# EAGLE schematic communication_module_20190819_to_aj-doy (EAGLE 9.4.2)
AUTHOR: iPAS
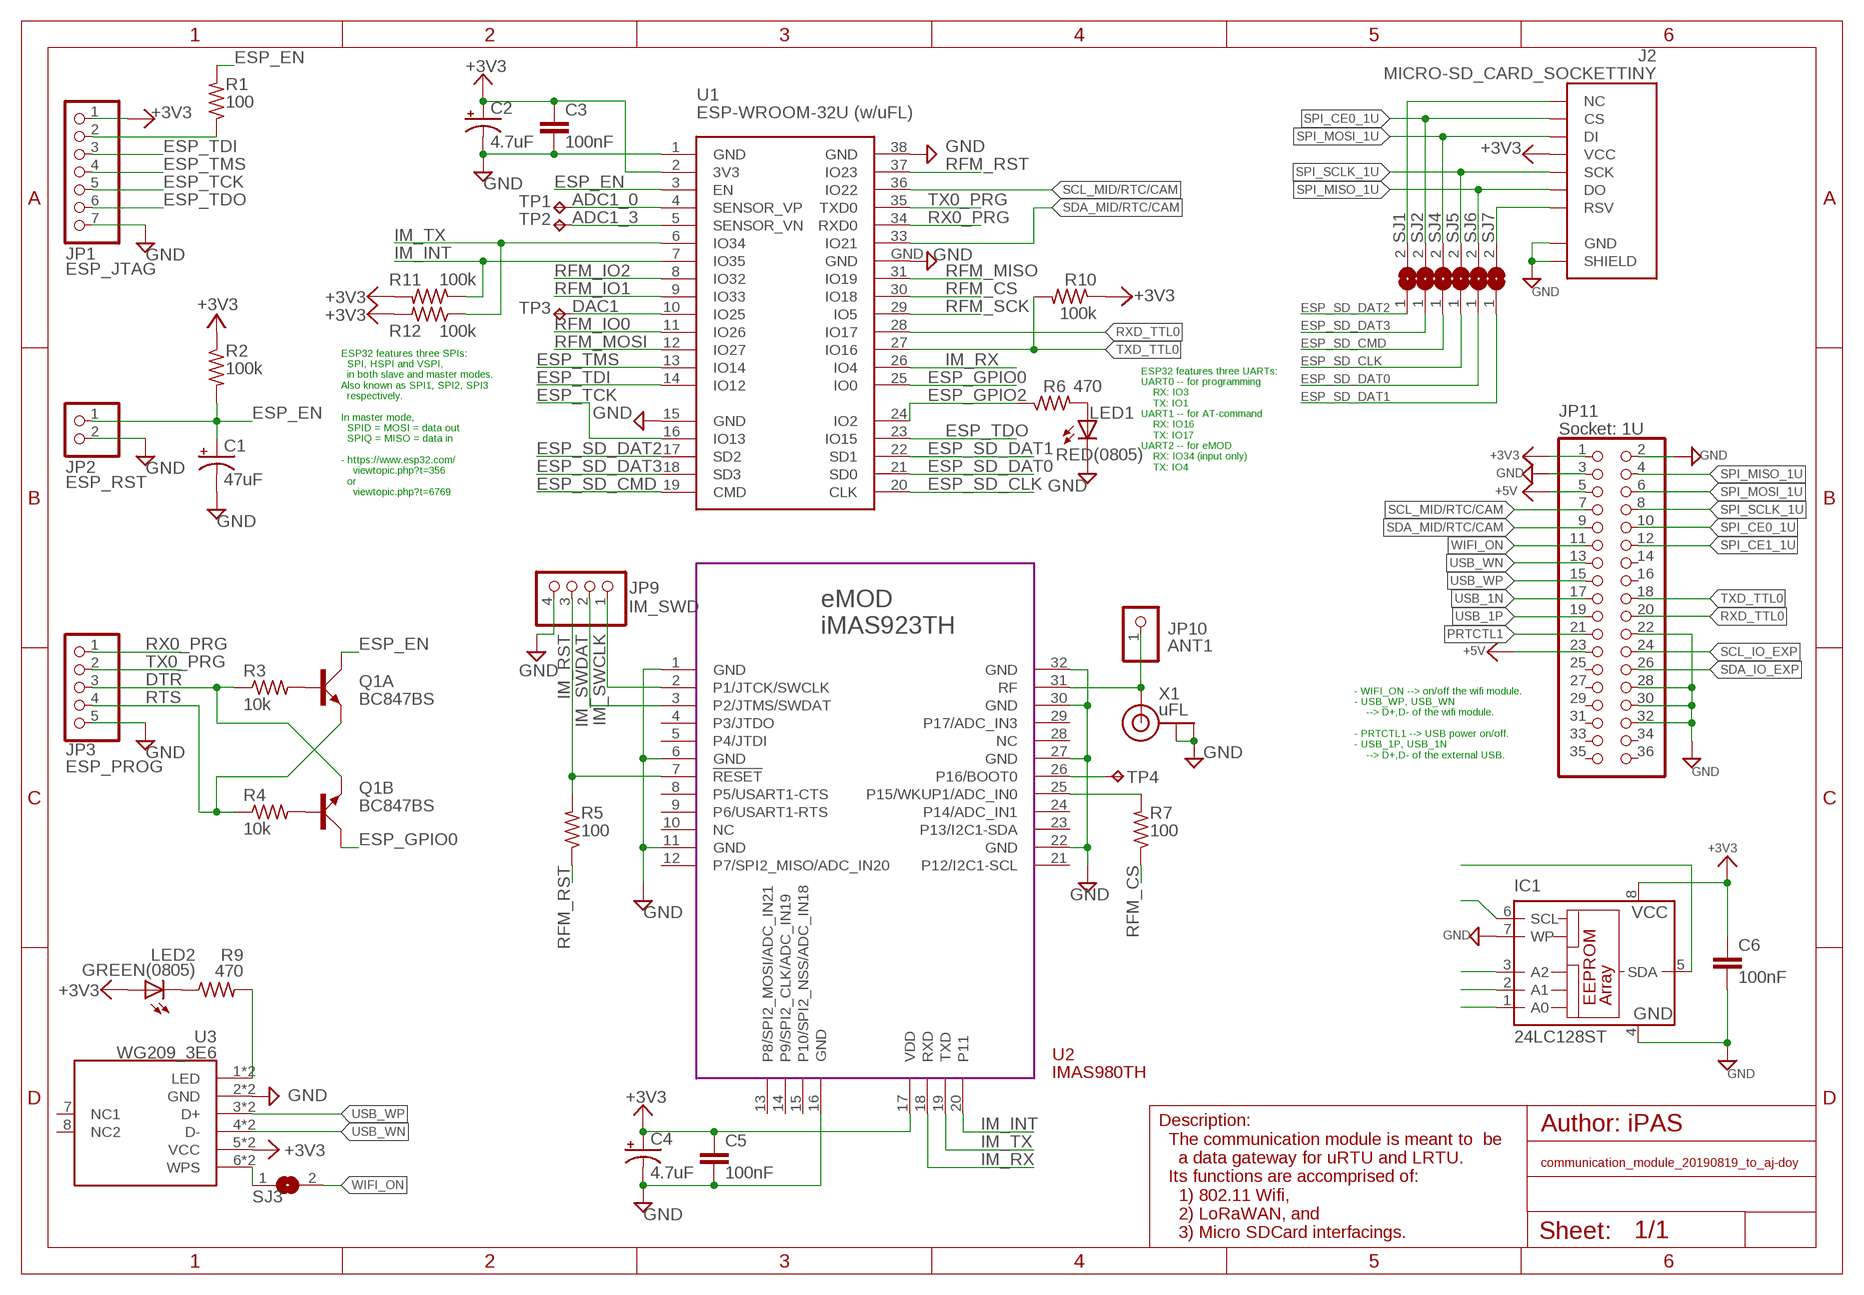
[diagram p0: schematic, sheet 1]

## Parts
C1  47uF  RCL_CPOL-US150CLZ-1014  [RCL_150CLZ-1014]
C2  4.7uF  RCL_CPOL-US150CLZ-1014  [RCL_150CLZ-1014]
C3  100nF  RCL_C-EUC1206  [RCL_C1206]
C4  4.7uF  RCL_CPOL-US150CLZ-1014  [RCL_150CLZ-1014]
C5  100nF  RCL_C-EUC1206  [RCL_C1206]
C6  100nF  RCL_C-EUC1206  [RCL_C1206]
IC1  24LC128ST  [TSSOP8]
J2  MICRO-SD_CARD_SOCKETTINY  [MICROSD_TINY]
JP1  ESP_JTAG  PINHD-1X7  [1X07]
JP2  ESP_RST  PINHD-1X2  [1X02]
JP3  ESP_PROG  PINHD-1X5  [1X05]
JP9  IM_SWD  PINHD-1X4  [1X04]
JP10  ANT1  HEADER-1X1ROUND  [1X01_ROUND]
JP11  Socket: 1U  PINHD-2X18  [2X18]
LED1  RED(0805)  LEDCHIP-LED0805  [CHIP-LED0805]
LED2  GREEN(0805)  LEDCHIP-LED0805  [CHIP-LED0805]
Q1  BC847BS  [SOT363_PHILIPS]
R1  100  RCL_R-USM0805  [RCL_M0805]
R2  100k  RCL_R-USM0805  [RCL_M0805]
R3  10k  RCL_R-USM0805  [RCL_M0805]
R4  10k  RCL_R-USM0805  [RCL_M0805]
R5  100  RCL_R-USM0805  [RCL_M0805]
R6  470  RCL_R-USM0805  [RCL_M0805]
R7  100  RCL_R-USM0805  [RCL_M0805]
R9  470  RCL_R-USM0805  [RCL_M0805]
R10  100k  RCL_R-USM0805  [RCL_M0805]
R11  100k  RCL_R-USM0805  [RCL_M0805]
R12  100k  RCL_R-USM0805  [RCL_M0805]
SJ1  SOLDERJUMPERREFLOW  [SOLDERJUMPER_REFLOW]
SJ2  SOLDERJUMPERREFLOW  [SOLDERJUMPER_REFLOW]
SJ3  SOLDERJUMPERREFLOW  [SOLDERJUMPER_REFLOW]
SJ4  SOLDERJUMPERREFLOW  [SOLDERJUMPER_REFLOW]
SJ5  SOLDERJUMPERREFLOW  [SOLDERJUMPER_REFLOW]
SJ6  SOLDERJUMPERREFLOW  [SOLDERJUMPER_REFLOW]
SJ7  SOLDERJUMPERREFLOW  [SOLDERJUMPER_REFLOW]
TP1  TPB1,27  [B1,27]
TP2  TPB1,27  [B1,27]
TP3  TPB1,27  [B1,27]
TP4  TPB1,27  [B1,27]
U1  ESP-WROOM-32U (w/uFL)  ESP-WROOM-32  [ESP-WROOM-32]
U2  IMAS980TH  [IMAS923TH]
U3  WG209_3E6  WG209  [WG209]
X1  uFL  ANTENNA_U.FL  [U.FL]

## Nets
+3V3: C2.+ C3.1 C4.+ C5.1 C6.1 IC1.8(VCC) J2.4(VCC) JP1.1 JP11.1 LED2.A R2.1 R10.1 R11.2 R12.2 U1.2(3V3) U2.17(VDD) U3.5(VCC) U3.5P(VCC)
+5V: JP11.5 JP11.23
ADC1_0: TP1.TP U1.4(SENSOR_VP)
ADC1_3: TP2.TP U1.5(SENSOR_VN)
DAC1: TP3.TP U1.10(IO25)
DTR: JP3.3 Q1.4(B:E) R3.1
ESP_EN: C1.+ JP2.1 Q1.6(A:C) R1.2 R2.2 U1.3(EN)
ESP_GPIO0: Q1.3(B:C) U1.25(IO0)
ESP_GPIO2: R6.1 U1.24(IO2)
ESP_SD_CLK: SJ5.1 U1.20(CLK)
ESP_SD_CMD: SJ4.1 U1.19(CMD)
ESP_SD_DAT0: SJ6.1 U1.21(SD0)
ESP_SD_DAT1: SJ7.1 U1.22(SD1)
ESP_SD_DAT2: SJ1.1 U1.17(SD2)
ESP_SD_DAT3: SJ2.1 U1.18(SD3)
ESP_TCK: JP1.5 U1.16(IO13)
ESP_TDI: JP1.3 U1.14(IO12)
ESP_TDO: JP1.6 U1.23(IO15)
ESP_TMS: JP1.4 U1.13(IO14)
GND: C1.- C2.- C3.2 C4.- C5.2 C6.2 IC1.4(GND) IC1.7(WP) J2.6(GND) J2.GND1(SHIELD) J2.GND2(SHIELD) J2.GND3(SHIELD) J2.GND4(SHIELD) J2.GND5(SHIELD) J2.GND6(SHIELD) JP1.7 JP2.2 JP3.5 JP9.4 JP11.2 JP11.3 JP11.22 JP11.28 JP11.30 JP11.32 LED1.C U1.1(GND) U1.15(GND) U1.38(GND) U1.GND U2.1(GND) U2.6(GND) U2.11(GND) U2.16(GND) U2.22(GND) U2.27(GND) U2.30(GND) U2.32(GND) U3.2(GND) U3.2P(GND) X1.1(GND) X1.2(GND)
IM_INT: R11.1 U1.7(IO35) U2.20(P11)
IM_RST: JP9.3 R5.2 U2.7(!RESET)
IM_RX: U1.26(IO4) U2.18(RXD)
IM_SWCLK: JP9.1 U2.2(P1/JTCK/SWCLK)
IM_SWDAT: JP9.2 U2.3(P2/JTMS/SWDAT)
IM_TX: R12.1 U1.6(IO34) U2.19(TXD)
N$1: R9.2 U3.1(LED) U3.1P(LED)
N$2: SJ3.1 U3.6(WPS) U3.6P(WPS)
N$3: LED2.C R9.1
N$4: TP4.TP U2.26(P16/BOOT0)
N$5: R7.2 U2.25(P15/WKUP1/ADC_IN0)
N$6: LED1.A R6.2
N$7: J2.9(NC) SJ1.2
N$8: J2.1(RSV) J2.8(RSV) SJ7.2
N$9: JP10.1 U2.31(RF) X1.3(SIGNAL)
N$10: IC1.5(SDA)
N$11: IC1.6(SCL)
N$12: IC1.3(A2)
N$13: Q1.2(A:B) R3.2
N$14: Q1.5(B:B) R4.2
N$15: IC1.2(A1)
N$16: JP1.2 R1.1
N$17: IC1.1(A0)
PRTCTL1: JP11.21
RFM_CS: R7.1 U1.30(IO18)
RFM_IO0: U1.11(IO26)
RFM_IO1: U1.9(IO33)
RFM_IO2: U1.8(IO32)
RFM_MISO: U1.31(IO19)
RFM_MOSI: U1.12(IO27)
RFM_RST: R5.1 U1.37(IO23)
RFM_SCK: U1.29(IO5)
RTS: JP3.4 Q1.1(A:E) R4.1
RX0_PRG: JP3.1 U1.34(RXD0)
RXD_TTL0: JP11.20 U1.28(IO17)
SCL_IO_EXP: JP11.24
SCL_MID/RTC/CAM: JP11.7 U1.36(IO22)
SDA_IO_EXP: JP11.26
SDA_MID/RTC/CAM: JP11.9 U1.33(IO21)
SPI_CE0_1U: J2.2(CS) JP11.10 SJ2.2
SPI_CE1_1U: JP11.12
SPI_MISO_1U: J2.7(DO) JP11.4 SJ6.2
SPI_MOSI_1U: J2.3(DI) JP11.6 SJ4.2
SPI_SCLK_1U: J2.5(SCK) JP11.8 SJ5.2
TX0_PRG: JP3.2 U1.35(TXD0)
TXD_TTL0: JP11.18 R10.2 U1.27(IO16)
USB_1N: JP11.17
USB_1P: JP11.19
USB_WN: JP11.13 U3.4(D-) U3.4P(D-)
USB_WP: JP11.15 U3.3(D+) U3.3P(D+)
WIFI_ON: JP11.11 SJ3.2
Unconnected: JP11.14 JP11.16 JP11.25 JP11.27 JP11.29 JP11.31 JP11.33 JP11.34 JP11.35 JP11.36 U2.4(P3/JTDO) U2.5(P4/JTDI) U2.8(P5/USART1-CTS) U2.9(P6/USART1-RTS) U2.10(NC) U2.12(P7/SPI2_MISO/ADC_IN20) U2.13(P8/SPI2_MOSI/ADC_IN21) U2.14(P9/SPI2_CLK/ADC_IN19) U2.15(P10/SPI2_NSS/ADC_IN18) U2.21(P12/I2C1-SCL) U2.23(P13/I2C1-SDA) U2.24(P14/ADC_IN1) U2.28(NC) U2.29(P17/ADC_IN3) U3.7(NC1) U3.8(NC2)

## Notes on the sheet
- ESP32 features three SPIs:
    SPI, HSPI and VSPI,
    in both slave and master modes. 
  Also known as SPI1, SPI2, SPI3 
    respectively.
  
  In master mode,
    SPID = MOSI = data out
    SPIQ = MISO = data in
  
  - https://www.esp32.com/
      viewtopic.php?t=356
    or  
      viewtopic.php?t=6769
- ESP32 features three UARTs:
  UART0 -- for programming
      RX: IO3
      TX: IO1
  UART1 -- for AT-command
      RX: IO16
      TX: IO17
  UART2 -- for eMOD
      RX: IO34 (input only)
      TX: IO4
- - WIFI_ON --> on/off the wifi module.
  - USB_WP, USB_WN
      --> D+,D- of the wifi module.
  
  - PRTCTL1 --> USB power on/off.
  - USB_1P, USB_1N
      --> D+,D- of the external USB.
- Author: iPAS
- Description:
    The communication module is meant to  be 
      a data gateway for uRTU and LRTU.
    Its functions are accomprised of:
      1) 802.11 Wifi,
      2) LoRaWAN, and
      3) Micro SDCard interfacings.

## Library data of the parts
C1 C2 C4 = ipas:RCL_CPOL-US: POLARIZED CAPACITOR, American symbol
C3 C5 C6 = ipas:RCL_C-EU: CAPACITOR, European symbol
IC1 = microchip:24*: Serial EEPROM I2C; MF: MICROCHIP; MPN: 24LC128-I/ST; OC_FARNELL: 1296573; OC_NEWARK: 62K0578
J2 = SparkFun-Connectors:MICRO-SD_CARD_SOCKET: microSD Socket for Transflash Push-push type µSD socket. tDoc lines correctly indicate media card edge positions when inserting (unlocked, locked, depressed). NOTE: CD1 and CD2 are connected internally, and the default detect state of the socket is detect pin to ground. SparkFun Products: WAV Trigger <https://www.sparkfun.com/products/13660> CAN-Bus Shield <https://www.sparkfun.com/products/13262> SparkFun Level Shifing microSD Breakout <https://www.sparkfun.com/products/13743>; PROD_ID: CONN-13500
JP1 = pinhead:PINHD-1X7: PIN HEADER
JP2 = pinhead:PINHD-1X2: PIN HEADER
JP3 = pinhead:PINHD-1X5: PIN HEADER
JP9 = pinhead:PINHD-1X4: PIN HEADER
JP10 = microbuilder:HEADER-1X1: PIN HEADER
JP11 = pinhead:PINHD-2X18: PIN HEADER
LED1 LED2 = led:LED: LED OSRAM: - CHIPLED LG R971, LG N971, LY N971, LG Q971, LY Q971, LO R971, LY R971 LH N974, LH R974 LS Q976, LO Q976, LY Q976 LO Q996 - Hyper CHIPLED LW Q18S LB Q993, LB Q99A, LB R99A - SideLED LS A670, LO A670, LY A670, LG A670, LP A670 LB A673, LV A673, LT A673, LW A673 LH A674 LY A675 LS A676, LA A676, LO A676, LY A676, LW A676 LS A679, LY A679, LG A679 - Hyper Micro SIDELED® LS Y876, LA Y876, LO Y876, LY Y876 LT Y87S - SmartLED LW L88C, LW L88S LB L89C, LB L89S, LG L890 LS L89K, LO L89K, LY L89K LS L896, LA L896, LO L896, LY L896 - TOPLED LS T670, LO T670, LY T670, LG T670, LP T670 LSG T670, LSP T670, LSY T670, LOP T670, LYG T670 LG T671, LOG T671, LSG T671 LB T673, LV T673, LT T673, LW T673 LH T674 LS T676, LA T676, LO T676, LY T676, LB T676, LH T676, LSB T676, LW T676 LB T67C, LV T67C, LT T67C, LS T67K, LO T67K, LY T67K, LW E67C LS E67B, LA E67B, LO E67B, LY E67B, LB E67C, LV E67C, LT E67C LW T67C LS T679, LY T679, LG T679 LS T770, LO T770, LY T770, LG T770, LP T770 LB T773, LV T773, LT T773, LW T773 LH T774 LS E675, LA E675, LY E675, LS T675 LS T776, LA T776, LO T776, LY T776, LB T776 LHGB T686 LT T68C, LB T68C - Hyper Mini TOPLED® LB M676 - Mini TOPLED Santana® LG M470 LS M47K, LO M47K, LY M47K Source: http://www.osram.convergy.de LUXEON: - LUMILED® LXK2-PW12-R00, LXK2-PW12-S00, LXK2-PW14-U00, LXK2-PW14-V00 LXK2-PM12-R00, LXK2-PM12-S00, LXK2-PM14-U00 LXK2-PE12-Q00, LXK2-PE12-R00, LXK2-PE12-S00, LXK2-PE14-T00, LXK2-PE14-U00 LXK2-PB12-K00, LXK2-PB12-L00, LXK2-PB12-M00, LXK2-PB14-N00, LXK2-PB14-P00, LXK2-PB14-Q00 LXK2-PR12-L00, LXK2-PR12-M00, LXK2-PR14-Q00, LXK2-PR14-R00 LXK2-PD12-Q00, LXK2-PD12-R00, LXK2-PD12-S00 LXK2-PH12-R00, LXK2-PH12-S00 LXK2-PL12-P00, LXK2-PL12-Q00, LXK2-PL12-R00 Source: www.luxeon.com KINGBRIGHT: KA-3528ASYC Source: www.kingbright.com
Q1 = transistor-small-signal:BC847BS: NPN general purpose double transistor Source: http://www.farnell.com/datasheets/2466.pdf
R1-R7 R9-R12 = ipas:RCL_R-US: RESISTOR, American symbol
SJ1-SJ7 = ipas:SOLDERJUMPER: SMD Solder JUMPER Solder the two pads together to create a connection, or remove the solder to break it. REFLOW - Use this footprint for solder paste and reflow ovens. WAVE - Use this footprint for hand-soldering (larger pads). CLOSED - Has a trace between the two pads to ensure it is closed by default. The trace needs to be cut to disable the jumper, and can be closed again by creating a solder bridge between the two pads.
TP1-TP4 = ipas:TP: Test pad
U1 = esp32:ESP-WROOM-32: Espressif Systems ESP-WROOM-32
U2 = IMAS923TH:IMAS980TH: eMOD iMAS923TH EmOne (Thailand) Co.,Ltd. 39/1 Soi. Sangkhom Songkhro 12 Lat Phrao, Bangkok 10230 Thailand Eable library Created by EmOne @ 2018
U3 = ipas:WG209: WiFi Module WG209 WG209 is a 802.11n/ b/g WiFi one-stream USB interface designed specifically to provide enhanced WiFi performance and value for home gateways, set-top boxes, gaming consoles, printers, IP cameras, and variety of other products that host processors not originally intended to support WiFi functions. WG209's MT7601 single-chip features a new architecture that integrates both a CPU and memory to run more of the WiFi function on-chip. The integrated CPU offloads the wireless processing overhead from the host appliance and enables consumer electronic devices to support WiFi functions seamlessly without change of original host processors. http://www.skylab.com.cn/en/productview-77.html
X1 = microbuilder:ANTENNA_U.FL: U.FL Antenna Connector